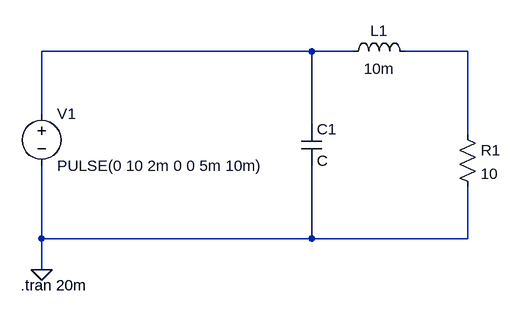
[diagram p0: schematic actual-circuit.asc]
actual-circuit.asc, the LTspice schematic file:
Version 4.1
SHEET 1 880 680
WIRE 384 0 -32 0
WIRE 448 0 384 0
WIRE 624 0 528 0
WIRE -32 96 -32 0
WIRE 384 112 384 0
WIRE 624 128 624 0
WIRE -32 288 -32 176
WIRE 384 288 384 176
WIRE 384 288 -32 288
WIRE 624 288 624 208
WIRE 624 288 384 288
WIRE -32 336 -32 288
FLAG -32 336 0
SYMBOL voltage -32 80 R0
WINDOW 123 0 0 Left 0
WINDOW 39 0 0 Left 0
SYMATTR InstName V1
SYMATTR Value PULSE(0 10 2m 0 0 5m 10m)
SYMBOL res 608 112 R0
SYMATTR InstName R1
SYMATTR Value 10
SYMBOL ind 432 16 R270
WINDOW 0 32 56 VTop 2
WINDOW 3 5 56 VBottom 2
SYMATTR InstName L1
SYMATTR Value 10m
SYMBOL cap 368 112 R0
SYMATTR InstName C1
TEXT -64 360 Left 2 !.tran 20m

The netlist it stands for:
* actual-circuit.asc
V1 N001 0 PULSE(0 10 2m 0 0 5m 10m)
R1 N002 0 10
L1 N001 N002 10m
C1 N001 0 C
.tran 20m
.backanno
.end